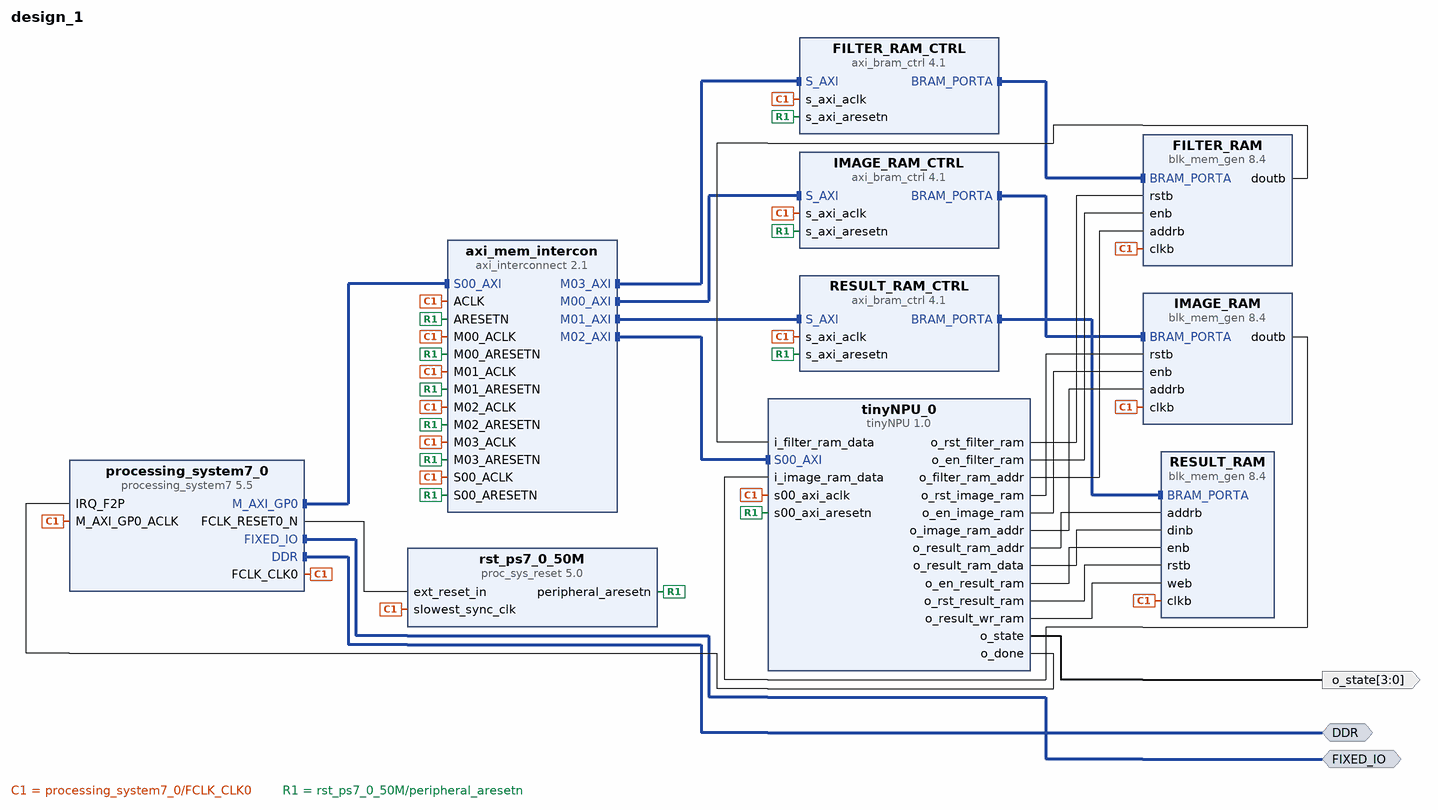
[diagram p0: block diagram of the top level]
# Vivado block design design_1, xc7z020clg400-1, Vivado 2019.1
create_bd_design design_1

create_bd_intf_port -mode Master -vlnv xilinx.com:interface:ddrx_rtl:1.0 DDR
create_bd_intf_port -mode Master -vlnv xilinx.com:display_processing_system7:fixedio_rtl:1.0 FIXED_IO
create_bd_port -dir O -from 3 -to 0 -type data o_state

create_bd_cell -type ip -vlnv xilinx.com:ip:blk_mem_gen:8.4 IMAGE_RAM
set_property -dict [list \
  CONFIG.Assume_Synchronous_Clk true \
  CONFIG.EN_SAFETY_CKT true \
  CONFIG.Enable_32bit_Address true \
  CONFIG.Enable_B Use_ENB_Pin \
  CONFIG.Memory_Type True_Dual_Port_RAM \
  CONFIG.Port_B_Clock 100 \
  CONFIG.Port_B_Enable_Rate 100 \
  CONFIG.Port_B_Write_Rate 50 \
  CONFIG.Register_PortA_Output_of_Memory_Primitives false \
  CONFIG.Register_PortB_Output_of_Memory_Primitives false \
  CONFIG.Use_RSTA_Pin true \
  CONFIG.Use_RSTB_Pin true \
  CONFIG.use_bram_block BRAM_Controller \
] [get_bd_cells IMAGE_RAM]
create_bd_cell -type ip -vlnv xilinx.com:ip:blk_mem_gen:8.4 FILTER_RAM
set_property -dict [list \
  CONFIG.Assume_Synchronous_Clk true \
  CONFIG.EN_SAFETY_CKT true \
  CONFIG.Enable_32bit_Address true \
  CONFIG.Enable_B Use_ENB_Pin \
  CONFIG.Memory_Type True_Dual_Port_RAM \
  CONFIG.Port_B_Clock 100 \
  CONFIG.Port_B_Enable_Rate 100 \
  CONFIG.Port_B_Write_Rate 50 \
  CONFIG.Register_PortA_Output_of_Memory_Primitives false \
  CONFIG.Register_PortB_Output_of_Memory_Primitives false \
  CONFIG.Use_RSTA_Pin true \
  CONFIG.Use_RSTB_Pin true \
  CONFIG.use_bram_block BRAM_Controller \
] [get_bd_cells FILTER_RAM]
create_bd_cell -type ip -vlnv xilinx.com:ip:blk_mem_gen:8.4 RESULT_RAM
set_property -dict [list \
  CONFIG.Assume_Synchronous_Clk true \
  CONFIG.EN_SAFETY_CKT true \
  CONFIG.Enable_32bit_Address true \
  CONFIG.Enable_B Use_ENB_Pin \
  CONFIG.Memory_Type True_Dual_Port_RAM \
  CONFIG.Port_B_Clock 100 \
  CONFIG.Port_B_Enable_Rate 100 \
  CONFIG.Port_B_Write_Rate 50 \
  CONFIG.Register_PortA_Output_of_Memory_Primitives false \
  CONFIG.Register_PortB_Output_of_Memory_Primitives false \
  CONFIG.Use_RSTA_Pin true \
  CONFIG.Use_RSTB_Pin true \
  CONFIG.use_bram_block BRAM_Controller \
] [get_bd_cells RESULT_RAM]
create_bd_cell -type ip -vlnv xilinx.com:ip:axi_bram_ctrl:4.1 IMAGE_RAM_CTRL
set_property -dict {CONFIG.PROTOCOL AXI4LITE CONFIG.SINGLE_PORT_BRAM 1} [get_bd_cells IMAGE_RAM_CTRL]
create_bd_cell -type ip -vlnv xilinx.com:ip:axi_bram_ctrl:4.1 RESULT_RAM_CTRL
set_property -dict {CONFIG.PROTOCOL AXI4LITE CONFIG.SINGLE_PORT_BRAM 1} [get_bd_cells RESULT_RAM_CTRL]
create_bd_cell -type ip -vlnv xilinx.com:ip:processing_system7:5.5 processing_system7_0
set_property -dict [list \
  CONFIG.PCW_APU_PERIPHERAL_FREQMHZ 666.666666 \
  CONFIG.PCW_ENET0_ENET0_IO {MIO 16 .. 27} \
  CONFIG.PCW_ENET0_GRP_MDIO_ENABLE 1 \
  CONFIG.PCW_ENET0_GRP_MDIO_IO {MIO 52 .. 53} \
  CONFIG.PCW_ENET0_PERIPHERAL_ENABLE 1 \
  CONFIG.PCW_ENET0_RESET_ENABLE 0 \
  CONFIG.PCW_ENET_RESET_ENABLE 1 \
  CONFIG.PCW_ENET_RESET_SELECT {Share reset pin} \
  CONFIG.PCW_GPIO_MIO_GPIO_ENABLE 1 \
  CONFIG.PCW_GPIO_MIO_GPIO_IO MIO \
  CONFIG.PCW_I2C_RESET_ENABLE 1 \
  CONFIG.PCW_IRQ_F2P_INTR 1 \
  CONFIG.PCW_PRESET_BANK1_VOLTAGE {LVCMOS 1.8V} \
  CONFIG.PCW_QSPI_GRP_FBCLK_ENABLE 1 \
  CONFIG.PCW_QSPI_GRP_FBCLK_IO {MIO 8} \
  CONFIG.PCW_QSPI_GRP_SINGLE_SS_ENABLE 1 \
  CONFIG.PCW_QSPI_GRP_SINGLE_SS_IO {MIO 1 .. 6} \
  CONFIG.PCW_QSPI_PERIPHERAL_ENABLE 1 \
  CONFIG.PCW_QSPI_QSPI_IO {MIO 1 .. 6} \
  CONFIG.PCW_SD0_GRP_CD_ENABLE 1 \
  CONFIG.PCW_SD0_GRP_CD_IO {MIO 47} \
  CONFIG.PCW_SD0_GRP_WP_ENABLE 0 \
  CONFIG.PCW_SD0_PERIPHERAL_ENABLE 1 \
  CONFIG.PCW_SD0_SD0_IO {MIO 40 .. 45} \
  CONFIG.PCW_SDIO_PERIPHERAL_FREQMHZ 50 \
  CONFIG.PCW_SINGLE_QSPI_DATA_MODE x4 \
  CONFIG.PCW_UART1_PERIPHERAL_ENABLE 1 \
  CONFIG.PCW_UART1_UART1_IO {MIO 48 .. 49} \
  CONFIG.PCW_UART_PERIPHERAL_FREQMHZ 100 \
  CONFIG.PCW_UIPARAM_DDR_FREQ_MHZ 533.333333 \
  CONFIG.PCW_UIPARAM_DDR_MEMORY_TYPE {DDR 3 (Low Voltage)} \
  CONFIG.PCW_UIPARAM_DDR_PARTNO {MT41K256M16 RE-125} \
  CONFIG.PCW_USB0_PERIPHERAL_ENABLE 1 \
  CONFIG.PCW_USB0_RESET_ENABLE 1 \
  CONFIG.PCW_USB0_RESET_IO {MIO 46} \
  CONFIG.PCW_USB0_USB0_IO {MIO 28 .. 39} \
  CONFIG.PCW_USB_RESET_ENABLE 1 \
  CONFIG.PCW_USB_RESET_SELECT {Share reset pin} \
  CONFIG.PCW_USE_FABRIC_INTERRUPT 1 \
] [get_bd_cells processing_system7_0]
# 296 more settings of processing_system7_0 are not shown: defaults, MIO pin electricals, DDR timing, and values the tool derives
create_bd_cell -type ip -vlnv xilinx.com:ip:axi_interconnect:2.1 axi_mem_intercon
set_property -dict {CONFIG.NUM_MI 4} [get_bd_cells axi_mem_intercon]
create_bd_cell -type ip -vlnv xilinx.com:ip:proc_sys_reset:5.0 rst_ps7_0_50M
create_bd_cell -type ip -vlnv xilinx.com:ip:axi_bram_ctrl:4.1 FILTER_RAM_CTRL
set_property -dict {CONFIG.PROTOCOL AXI4LITE CONFIG.SINGLE_PORT_BRAM 1} [get_bd_cells FILTER_RAM_CTRL]
create_bd_cell -type ip -vlnv xilinx.com:user:tinyNPU:1.0 tinyNPU_0

# ---- connections ----

connect_bd_intf_net [get_bd_intf_pins IMAGE_RAM_CTRL/BRAM_PORTA] [get_bd_intf_pins IMAGE_RAM/BRAM_PORTA]
connect_bd_intf_net [get_bd_intf_pins axi_mem_intercon/M01_AXI] [get_bd_intf_pins RESULT_RAM_CTRL/S_AXI]
connect_bd_intf_net [get_bd_intf_ports FIXED_IO] [get_bd_intf_pins processing_system7_0/FIXED_IO]
connect_bd_intf_net [get_bd_intf_ports DDR] [get_bd_intf_pins processing_system7_0/DDR]
connect_bd_intf_net [get_bd_intf_pins axi_mem_intercon/M02_AXI] [get_bd_intf_pins tinyNPU_0/S00_AXI]
connect_bd_intf_net [get_bd_intf_pins RESULT_RAM_CTRL/BRAM_PORTA] [get_bd_intf_pins RESULT_RAM/BRAM_PORTA]
connect_bd_intf_net [get_bd_intf_pins axi_mem_intercon/M03_AXI] [get_bd_intf_pins FILTER_RAM_CTRL/S_AXI]
connect_bd_intf_net [get_bd_intf_pins FILTER_RAM/BRAM_PORTA] [get_bd_intf_pins FILTER_RAM_CTRL/BRAM_PORTA]
connect_bd_intf_net [get_bd_intf_pins processing_system7_0/M_AXI_GP0] [get_bd_intf_pins axi_mem_intercon/S00_AXI]
connect_bd_intf_net [get_bd_intf_pins axi_mem_intercon/M00_AXI] [get_bd_intf_pins IMAGE_RAM_CTRL/S_AXI]
connect_bd_net [get_bd_pins tinyNPU_0/o_done] [get_bd_pins processing_system7_0/IRQ_F2P]
connect_bd_net [get_bd_pins tinyNPU_0/o_rst_image_ram] [get_bd_pins IMAGE_RAM/rstb]
connect_bd_net [get_bd_pins tinyNPU_0/o_en_image_ram] [get_bd_pins IMAGE_RAM/enb]
connect_bd_net [get_bd_pins tinyNPU_0/o_image_ram_addr] [get_bd_pins IMAGE_RAM/addrb]
connect_bd_net [get_bd_pins tinyNPU_0/o_rst_filter_ram] [get_bd_pins FILTER_RAM/rstb]
connect_bd_net [get_bd_pins tinyNPU_0/o_en_filter_ram] [get_bd_pins FILTER_RAM/enb]
connect_bd_net [get_bd_pins tinyNPU_0/o_filter_ram_addr] [get_bd_pins FILTER_RAM/addrb]
connect_bd_net [get_bd_pins IMAGE_RAM/doutb] [get_bd_pins tinyNPU_0/i_image_ram_data]
connect_bd_net [get_bd_pins FILTER_RAM/doutb] [get_bd_pins tinyNPU_0/i_filter_ram_data]
connect_bd_net [get_bd_pins tinyNPU_0/o_result_ram_addr] [get_bd_pins RESULT_RAM/addrb]
connect_bd_net [get_bd_pins tinyNPU_0/o_result_ram_data] [get_bd_pins RESULT_RAM/dinb]
connect_bd_net [get_bd_pins tinyNPU_0/o_en_result_ram] [get_bd_pins RESULT_RAM/enb]
connect_bd_net [get_bd_pins tinyNPU_0/o_rst_result_ram] [get_bd_pins RESULT_RAM/rstb]
connect_bd_net [get_bd_pins tinyNPU_0/o_result_wr_ram] [get_bd_pins RESULT_RAM/web]
connect_bd_net [get_bd_pins processing_system7_0/FCLK_CLK0] \
  [get_bd_pins processing_system7_0/M_AXI_GP0_ACLK] [get_bd_pins axi_mem_intercon/S00_ACLK] \
  [get_bd_pins rst_ps7_0_50M/slowest_sync_clk] [get_bd_pins IMAGE_RAM_CTRL/s_axi_aclk] \
  [get_bd_pins RESULT_RAM_CTRL/s_axi_aclk] [get_bd_pins IMAGE_RAM/clkb] [get_bd_pins FILTER_RAM/clkb] \
  [get_bd_pins RESULT_RAM/clkb] [get_bd_pins axi_mem_intercon/M00_ACLK] [get_bd_pins axi_mem_intercon/ACLK] \
  [get_bd_pins axi_mem_intercon/M01_ACLK] [get_bd_pins axi_mem_intercon/M02_ACLK] [get_bd_pins FILTER_RAM_CTRL/s_axi_aclk] \
  [get_bd_pins axi_mem_intercon/M03_ACLK] [get_bd_pins tinyNPU_0/s00_axi_aclk]
connect_bd_net [get_bd_pins processing_system7_0/FCLK_RESET0_N] [get_bd_pins rst_ps7_0_50M/ext_reset_in]
connect_bd_net [get_bd_pins rst_ps7_0_50M/peripheral_aresetn] \
  [get_bd_pins axi_mem_intercon/S00_ARESETN] [get_bd_pins IMAGE_RAM_CTRL/s_axi_aresetn] \
  [get_bd_pins RESULT_RAM_CTRL/s_axi_aresetn] [get_bd_pins axi_mem_intercon/M00_ARESETN] \
  [get_bd_pins axi_mem_intercon/ARESETN] [get_bd_pins axi_mem_intercon/M01_ARESETN] \
  [get_bd_pins axi_mem_intercon/M02_ARESETN] [get_bd_pins FILTER_RAM_CTRL/s_axi_aresetn] \
  [get_bd_pins axi_mem_intercon/M03_ARESETN] [get_bd_pins tinyNPU_0/s00_axi_aresetn]
connect_bd_net [get_bd_pins tinyNPU_0/o_state] [get_bd_ports o_state]
set_property HDL_ATTRIBUTE.BMM_INFO_ADDRESS_SPACE {byte  0x40000000 32 > design_1 IMAGE_RAM} [get_bd_cells IMAGE_RAM_CTRL]
set_property HDL_ATTRIBUTE.KEEP_HIERARCHY yes [get_bd_cells IMAGE_RAM_CTRL]
set_property HDL_ATTRIBUTE.BMM_INFO_ADDRESS_SPACE {byte  0x42000000 32 > design_1 RESULT_RAM} [get_bd_cells RESULT_RAM_CTRL]
set_property HDL_ATTRIBUTE.KEEP_HIERARCHY yes [get_bd_cells RESULT_RAM_CTRL]
set_property HDL_ATTRIBUTE.BMM_INFO_PROCESSOR {arm > design_1 IMAGE_RAM_CTRL design_1 RESULT_RAM_CTRL design_1 FILTER_RAM_CTRL} [get_bd_cells processing_system7_0]
set_property HDL_ATTRIBUTE.KEEP_HIERARCHY yes [get_bd_cells processing_system7_0]
set_property HDL_ATTRIBUTE.BMM_INFO_ADDRESS_SPACE {byte  0x44000000 32 > design_1 FILTER_RAM} [get_bd_cells FILTER_RAM_CTRL]
set_property HDL_ATTRIBUTE.KEEP_HIERARCHY yes [get_bd_cells FILTER_RAM_CTRL]

# ---- address map ----
assign_bd_address -offset 0x40000000 -range 8K -target_address_space [get_bd_addr_spaces processing_system7_0/Data] [get_bd_addr_segs IMAGE_RAM_CTRL/S_AXI/Mem0]
assign_bd_address -offset 0x42000000 -range 8K -target_address_space [get_bd_addr_spaces processing_system7_0/Data] [get_bd_addr_segs RESULT_RAM_CTRL/S_AXI/Mem0]
assign_bd_address -offset 0x43C00000 -range 64K -target_address_space [get_bd_addr_spaces processing_system7_0/Data] [get_bd_addr_segs tinyNPU_0/S00_AXI/S00_AXI_reg]
assign_bd_address -offset 0x44000000 -range 8K -target_address_space [get_bd_addr_spaces processing_system7_0/Data] [get_bd_addr_segs FILTER_RAM_CTRL/S_AXI/Mem0]

validate_bd_design
save_bd_design
